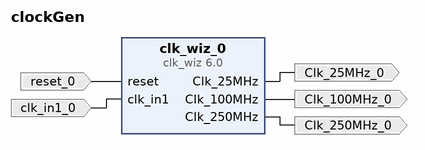
[diagram p0: block diagram of the top level]
# Vivado block design clockGen, xc7z020clg400-3, Vivado 2020.2
create_bd_design clockGen

create_bd_port -dir O -type clk Clk_25MHz_0
set_property -dict {CONFIG.FREQ_HZ 25000000} [get_bd_ports Clk_25MHz_0]
create_bd_port -dir I -type rst reset_0
set_property -dict {CONFIG.POLARITY ACTIVE_HIGH} [get_bd_ports reset_0]
create_bd_port -dir I -type clk clk_in1_0
create_bd_port -dir O -type clk Clk_250MHz_0
set_property -dict {CONFIG.FREQ_HZ 250000000} [get_bd_ports Clk_250MHz_0]
create_bd_port -dir O -type clk Clk_100MHz_0

create_bd_cell -type ip -vlnv xilinx.com:ip:clk_wiz:6.0 clk_wiz_0
set_property -dict [list \
  CONFIG.CLKOUT1_JITTER 175.402 \
  CONFIG.CLKOUT1_REQUESTED_OUT_FREQ 25 \
  CONFIG.CLKOUT2_JITTER 110.209 \
  CONFIG.CLKOUT2_PHASE_ERROR 98.575 \
  CONFIG.CLKOUT2_REQUESTED_OUT_FREQ 250 \
  CONFIG.CLKOUT2_USED true \
  CONFIG.CLKOUT3_JITTER 130.958 \
  CONFIG.CLKOUT3_PHASE_ERROR 98.575 \
  CONFIG.CLKOUT3_USED true \
  CONFIG.CLK_OUT1_PORT Clk_25MHz \
  CONFIG.CLK_OUT2_PORT Clk_250MHz \
  CONFIG.CLK_OUT3_PORT Clk_100MHz \
  CONFIG.MMCM_CLKOUT0_DIVIDE_F 40.000 \
  CONFIG.MMCM_CLKOUT1_DIVIDE 4 \
  CONFIG.MMCM_CLKOUT2_DIVIDE 10 \
  CONFIG.NUM_OUT_CLKS 3 \
  CONFIG.USE_LOCKED false \
] [get_bd_cells clk_wiz_0]

# ---- connections ----

connect_bd_net [get_bd_pins clk_wiz_0/Clk_25MHz] [get_bd_ports Clk_25MHz_0]
connect_bd_net -net reset_0_1 [get_bd_ports reset_0] [get_bd_pins clk_wiz_0/reset]
connect_bd_net -net clk_in1_0_1 [get_bd_ports clk_in1_0] [get_bd_pins clk_wiz_0/clk_in1]
connect_bd_net [get_bd_pins clk_wiz_0/Clk_250MHz] [get_bd_ports Clk_250MHz_0]
connect_bd_net [get_bd_pins clk_wiz_0/Clk_100MHz] [get_bd_ports Clk_100MHz_0]

validate_bd_design
save_bd_design
